# Altium project span-ion-cfd.PrjPcb
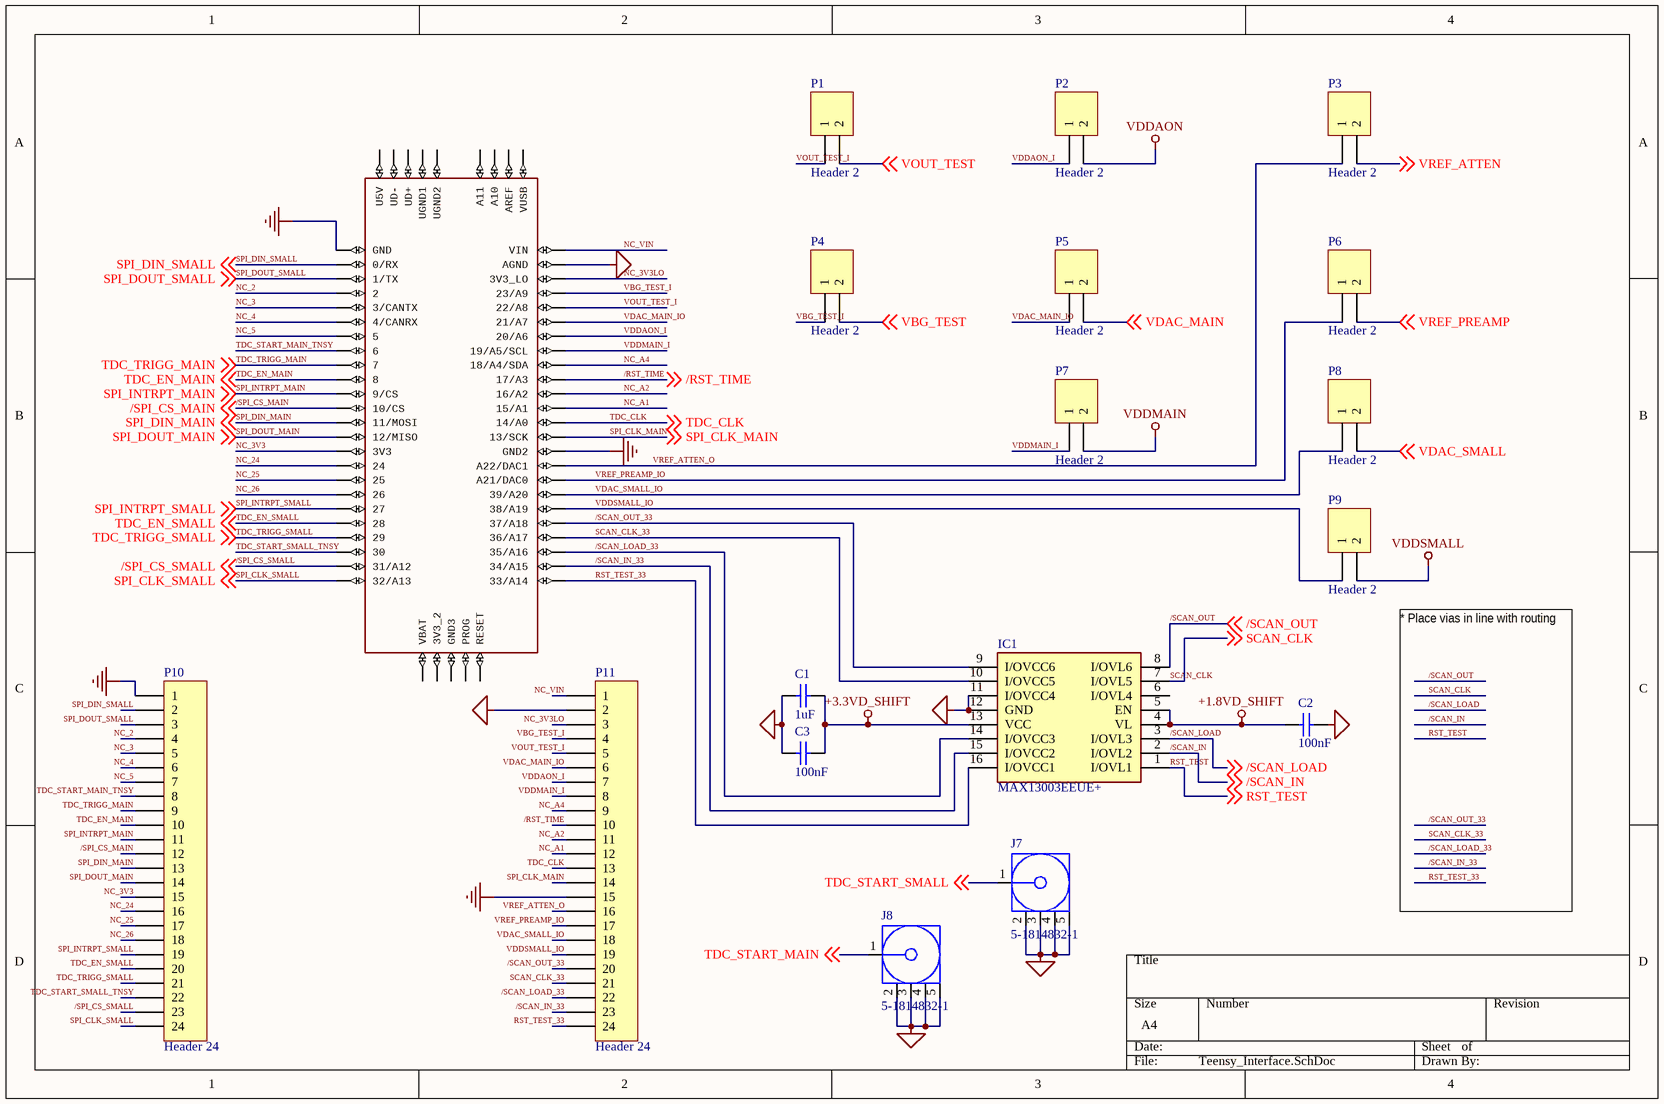
[diagram p0: Teensy_Interface.SchDoc]
4 sheets, 123 parts. Net scope: global (net labels, ports and power ports of the same name join across sheets).
Board file: CFD_Chip_Test.PcbDoc
Sheets:
  Teensy_Interface.SchDoc
  Chip.SchDoc
  Chip_Inputs.SchDoc
  Power.SchDoc

## Sheet Teensy_Interface.SchDoc
size A4; SheetNumber: 1; SheetTotal: 4

### Parts
C1  1uF  [CAPC1608X90X35ML10T15]
C2  100nF  [CAPC1608X90X35ML10T15]
C3  100nF  [CAPC1608X90X35ML10T15]
IC1  MAX13003EEUE+  [SOP65P640X110-16N]
J7  5-1814832-1  [TECO-5-1814832-1_V]
J8  5-1814832-1  [TECO-5-1814832-1_V]
P1  Header 2  [HDR1X2]
P2  Header 2  [HDR1X2]
P3  Header 2  [HDR1X2]
P4  Header 2  [HDR1X2]
P5  Header 2  [HDR1X2]
P6  Header 2  [HDR1X2]
P7  Header 2  [HDR1X2]
P8  Header 2  [HDR1X2]
P9  Header 2  [HDR1X2]
P10  Header 24  [HDR1X24]
P11  Header 24  [HDR1X24]
TEENSY1  TEENSY_3.5/3.6  [TEENSY_3.5/3.6]  (value not drawn)

### Nets
+1.8VD_SHIFT: C2.1 IC1.4(VL) IC1.5(EN)
+3.3VD_SHIFT: C1.2 C3.2 IC1.13(VCC)
GND: C1.1 C2.2 C3.1 IC1.11(I/OVCC4) IC1.12(GND) J7.2 J7.3 J7.4 J7.5 J8.2 J8.3 J8.4 J8.5 P10.1 P11.2 P11.15 TEENSY1.AGND TEENSY1.GND TEENSY1.GND2
VDDAON: P2.2
VDDMAIN: P7.2
VDDSMALL: P9.2
/RST_TIME: P11.10 TEENSY1.17/A3 ; off-sheet /RST_TIME
/SCAN_IN: IC1.2(I/OVL2) ; off-sheet /SCAN_IN
/SCAN_IN_33: IC1.15(I/OVCC2) P11.23 TEENSY1.34/A15
/SCAN_LOAD: IC1.3(I/OVL3) ; off-sheet /SCAN_LOAD
/SCAN_LOAD_33: IC1.14(I/OVCC3) P11.22 TEENSY1.35/A16
/SCAN_OUT: IC1.8(I/OVL6) ; off-sheet /SCAN_OUT
/SCAN_OUT_33: IC1.9(I/OVCC6) P11.20 TEENSY1.37/A18
/SPI_CS_MAIN: P10.12 TEENSY1.10/CS ; off-sheet /SPI_CS_MAIN
/SPI_CS_SMALL: P10.23 TEENSY1.31/A12 ; off-sheet /SPI_CS_SMALL
NC_2: P10.4 TEENSY1.2
NC_3: P10.5 TEENSY1.3/CANTX
NC_3V3: P10.15 TEENSY1.3V3
NC_3V3LO: P11.3 TEENSY1.3V3_LO
NC_4: P10.6 TEENSY1.4/CANRX
NC_5: P10.7 TEENSY1.5
NC_24: P10.16 TEENSY1.24
NC_25: P10.17 TEENSY1.25
NC_26: P10.18 TEENSY1.26
NC_A1: P11.12 TEENSY1.15/A1
NC_A2: P11.11 TEENSY1.16/A2
NC_A4: P11.9 TEENSY1.18/A4/SDA
NC_VIN: P11.1 TEENSY1.VIN
RST_TEST: IC1.1(I/OVL1) ; off-sheet RST_TEST
RST_TEST_33: IC1.16(I/OVCC1) P11.24 TEENSY1.33/A14
SCAN_CLK: IC1.7(I/OVL5) ; off-sheet SCAN_CLK
SCAN_CLK_33: IC1.10(I/OVCC5) P11.21 TEENSY1.36/A17
SPI_CLK_MAIN: P11.14 TEENSY1.13/SCK ; off-sheet SPI_CLK_MAIN
SPI_CLK_SMALL: P10.24 TEENSY1.32/A13 ; off-sheet SPI_CLK_SMALL
SPI_DIN_MAIN: P10.13 TEENSY1.11/MOSI ; off-sheet SPI_DIN_MAIN
SPI_DIN_SMALL: P10.2 TEENSY1.0/RX ; off-sheet SPI_DIN_SMALL
SPI_DOUT_MAIN: P10.14 TEENSY1.12/MISO ; off-sheet SPI_DOUT_MAIN
SPI_DOUT_SMALL: P10.3 TEENSY1.1/TX ; off-sheet SPI_DOUT_SMALL
SPI_INTRPT_MAIN: P10.11 TEENSY1.9/CS ; off-sheet SPI_INTRPT_MAIN
SPI_INTRPT_SMALL: P10.19 TEENSY1.27 ; off-sheet SPI_INTRPT_SMALL
TDC_CLK: P11.13 TEENSY1.14/A0 ; off-sheet TDC_CLK
TDC_EN_MAIN: P10.10 TEENSY1.8 ; off-sheet TDC_EN_MAIN
TDC_EN_SMALL: P10.20 TEENSY1.28 ; off-sheet TDC_EN_SMALL
TDC_START_MAIN: J8.1 ; off-sheet TDC_START_MAIN
TDC_START_MAIN_TNSY: P10.8 TEENSY1.6
TDC_START_SMALL: J7.1 ; off-sheet TDC_START_SMALL
TDC_START_SMALL_TNSY: P10.22 TEENSY1.30
TDC_TRIGG_MAIN: P10.9 TEENSY1.7 ; off-sheet TDC_TRIGG_MAIN
TDC_TRIGG_SMALL: P10.21 TEENSY1.29 ; off-sheet TDC_TRIGG_SMALL
VBG_TEST: P4.2 ; off-sheet VBG_TEST
VBG_TEST_I: P4.1 P11.4 TEENSY1.23/A9
VDAC_MAIN: P5.2 ; off-sheet VDAC_MAIN
VDAC_MAIN_IO: P5.1 P11.6 TEENSY1.21/A7
VDAC_SMALL: P8.2 ; off-sheet VDAC_SMALL
VDAC_SMALL_IO: P8.1 P11.18 TEENSY1.39/A20
VDDAON_I: P2.1 P11.7 TEENSY1.20/A6
VDDMAIN_I: P7.1 P11.8 TEENSY1.19/A5/SCL
VDDSMALL_IO: P9.1 P11.19 TEENSY1.38/A19
VOUT_TEST: P1.2 ; off-sheet VOUT_TEST
VOUT_TEST_I: P1.1 P11.5 TEENSY1.22/A8
VREF_ATTEN: P3.2 ; off-sheet VREF_ATTEN
VREF_ATTEN_O: P3.1 P11.16 TEENSY1.A22/DAC1
VREF_PREAMP: P6.2 ; off-sheet VREF_PREAMP
VREF_PREAMP_IO: P6.1 P11.17 TEENSY1.21/DAC0(A21/DAC0)

Not connected (* = marked no-connect by the designer): IC1 6(I/OVL4); TEENSY1 3V3_2 A10 A11 AREF GND3 PROG RESET U5V UD+ UD- UGND1 UGND2 VBAT VUSB

### Notes on the sheet
- * Place vias in line with routing

### Library data of the parts
C1-C3 = CMP-2000-04945-1: 0603; Manufacturer: Murata; Capacitance: 22pF; Tolerance (%): ±5%; Rated Voltage: 50V; Dielectric: C0G; Manufacturer URL: http://www.murata.com/; Datasheet Version: Jul-06; Package Reference: 603; Case Size/Dimension: 0603; Package Description: 2-Pin Surface Mount Device, Body 1.6 x 0.8 mm; Datasheet URL: https://datasheet.ciiva.com/11786/0900766b807a1cab-11786398.pdf
IC1 = MAX13003EEUE+: Integrated Circuit; Manufacturer_Name: Maxim Integrated; Datasheet Link: https://pdfserv.maximintegrated.com/en/ds/MAX13000E-MAX13005E.pdf; Height: 1.1mm; Manufacturer_Part_Number: MAX13003EEUE+
J7 J8 = CMP-2000-05415-1: SMA Connector, Pitch 5.08 mm, 1 Position, Height 9.5 mm, Tail Length 4 mm, -65 to 165 degC, RoHS, Bulk; Manufacturer: TE Connectivity; Connector Mounting: PCBMount; Connector Body Style: StraightJack; Impedance: 50ohm; Coaxial Termination: Solder; SVHC: NoSVHC(15-Jun-2015); Frequency Max: 3GHz; Product Range: ZDCSeries; Connector Type: SMACoaxial; Datasheet Version: Rev. B1, 03/2011; Package Reference: 5-1814832-1; Package Description: SMA Connector, Pitch 5.08 mm, 1 Position, Height 9.5 mm, Tail Length 4 mm; Contact Plating: GoldPlatedContacts; Coaxial Cable Types: -; Contact Material: BerylliumCopper; Manufacturer URL: http://www.te.com/; Datasheet URL: http://www.onlinecomponents.com/productFiles/mf-AMP/eng_cd_1814832_a.pdf
P1-P9 = Header 2: Header, 2-Pin; LatestRevisionDate: 17-Jul-2002; LatestRevisionNote: Re-released for DXP Platform.; Publisher: Altium Limited
P10 P11 = Header 24: Header, 24-Pin; LatestRevisionDate: 17-Jul-2002; LatestRevisionNote: Re-released for DXP Platform.; Publisher: Altium Limited
TEENSY1 = TEENSY_3.5/3.6: GateName_1: G$1; SymbolName_1: TEENSY_3.5/3.6; LibraryName: Teensy356; DeviceSetName: TEENSY_3.5/3.6; Package: TEENSY_3.5/3.6

## Sheet Chip.SchDoc
size A4; SheetNumber: 2; SheetTotal: 4
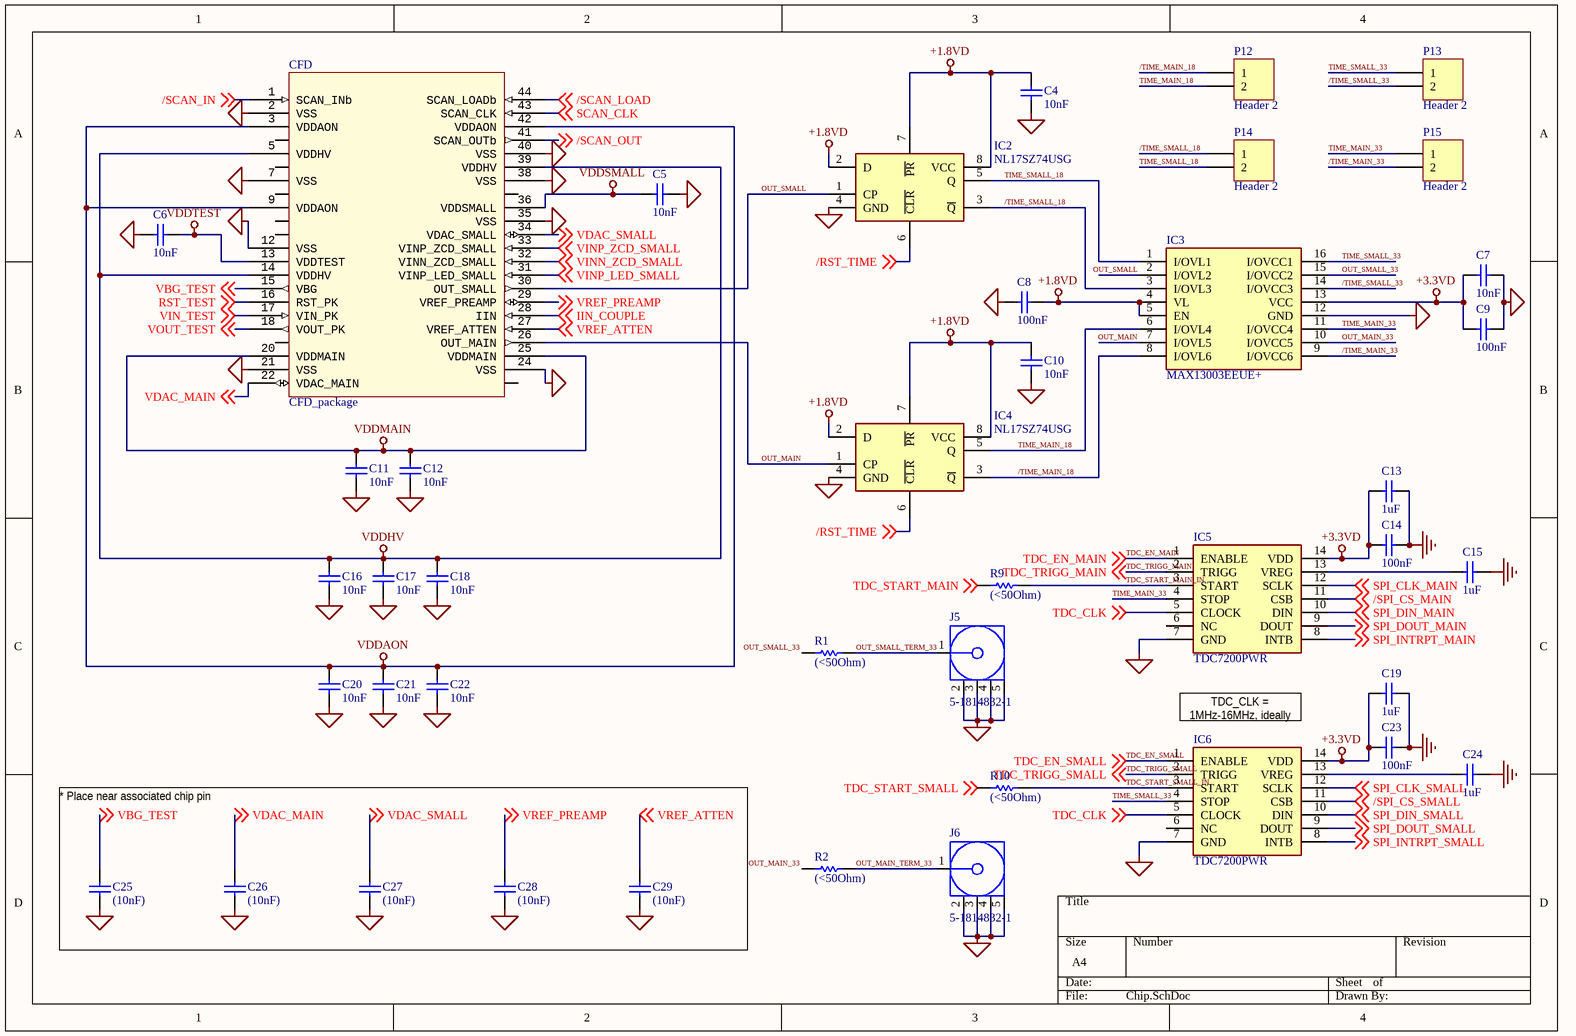
[diagram p1: Chip.SchDoc]

### Parts
C4  10nF  [CAPC1608X90X35ML10T15]
C5  10nF  [CAPC1608X90X35ML10T15]
C6  10nF  [CAPC1608X90X35ML10T15]
C7  10nF  [CAPC1608X90X35ML10T15]
C8  100nF  [CAPC1608X90X35ML10T15]
C9  100nF  [CAPC1608X90X35ML10T15]
C10  10nF  [CAPC1608X90X35ML10T15]
C11  10nF  [CAPC1608X90X35ML10T15]
C12  10nF  [CAPC1608X90X35ML10T15]
C13  1uF  [CAPC1608X90X35ML10T15]
C14  100nF  [CAPC1608X90X35ML10T15]
C15  1uF  [CAPC1608X90X35ML10T15]
C16  10nF  [CAPC1608X90X35ML10T15]
C17  10nF  [CAPC1608X90X35ML10T15]
C18  10nF  [CAPC1608X90X35ML10T15]
C19  1uF  [CAPC1608X90X35ML10T15]
C20  10nF  [CAPC1608X90X35ML10T15]
C21  10nF  [CAPC1608X90X35ML10T15]
C22  10nF  [CAPC1608X90X35ML10T15]
C23  100nF  [CAPC1608X90X35ML10T15]
C24  1uF  [CAPC1608X90X35ML10T15]
C25  (10nF)  [CAPC1608X90X35ML10T15]
C26  (10nF)  [CAPC1608X90X35ML10T15]
C27  (10nF)  [CAPC1608X90X35ML10T15]
C28  (10nF)  [CAPC1608X90X35ML10T15]
C29  (10nF)  [CAPC1608X90X35ML10T15]
CFD  CFD_package  [QFN50P700X700X80_HS-45N_WIDEVIAS]
IC2  NL17SZ74USG  [SOP50P310X90-8N]
IC3  MAX13003EEUE+  [SOP65P640X110-16N]
IC4  NL17SZ74USG  [SOP50P310X90-8N]
IC5  TDC7200PWR  [SOP65P640X120-14N]
IC6  TDC7200PWR  [SOP65P640X120-14N]
J5  5-1814832-1  [TECO-5-1814832-1_V]
J6  5-1814832-1  [TECO-5-1814832-1_V]
P12  Header 2  [HDR1X2]
P13  Header 2  [HDR1X2]
P14  Header 2  [HDR1X2]
P15  Header 2  [HDR1X2]
R1  (<50Ohm)  [RESC1609X50X30NL8T20]
R2  (<50Ohm)  [RESC1609X50X30NL8T20]
R9  (<50Ohm)  [RESC1609X50X30NL8T20]
R10  (<50Ohm)  [RESC1609X50X30NL8T20]

### Nets
+1.8VD: C4.2 C8.2 C10.2 IC2.2(D) IC2.7(~{PR}) IC2.8(VCC) IC3.4(VL) IC3.5(EN) IC4.2(D) IC4.7(~{PR}) IC4.8(VCC)
+3.3VD: C7.2 C9.2 C13.1 C14.1 C19.1 C23.1 IC3.13(VCC) IC5.14(VDD) IC6.14(VDD)
GND: C4.1 C5.1 C6.2 C7.1 C8.1 C9.1 C10.1 C11.1 C12.1 C13.2 C14.2 C15.2 C16.1 C17.1 C18.1 C19.2 C20.1 C21.1 C22.1 C23.2 C24.2 C25.1 C26.1 C27.1 C28.1 C29.1 CFD.2(VSS) CFD.7(VSS) CFD.12(VSS) CFD.21(VSS) CFD.24(VSS) CFD.35(VSS) CFD.38(VSS) CFD.40(VSS) IC2.4(GND) IC3.12(GND) IC4.4(GND) IC5.7(GND) IC6.7(GND) J5.2 J5.3 J5.4 J5.5 J6.2 J6.3 J6.4 J6.5
VDDAON: C20.2 C21.2 C22.2 CFD.3(VDDAON) CFD.9(VDDAON) CFD.42(VDDAON)
VDDHV: C16.2 C17.2 C18.2 CFD.5(VDDHV) CFD.14(VDDHV) CFD.39(VDDHV)
VDDMAIN: C11.2 C12.2 CFD.20(VDDMAIN) CFD.25(VDDMAIN)
VDDSMALL: C5.2 CFD.36(VDDSMALL)
VDDTEST: C6.1 CFD.13(VDDTEST)
/RST_TIME: IC2.6(~{CLR}) IC4.6(~{CLR}) ; off-sheet /RST_TIME
/SCAN_IN: CFD.1(SCAN_INb) ; off-sheet /SCAN_IN
/SCAN_LOAD: CFD.44(SCAN_LOADb) ; off-sheet /SCAN_LOAD
/SCAN_OUT: CFD.41(SCAN_OUTb) ; off-sheet /SCAN_OUT
/SPI_CS_MAIN: IC5.11(CSB) ; off-sheet /SPI_CS_MAIN
/SPI_CS_SMALL: IC6.11(CSB) ; off-sheet /SPI_CS_SMALL
/TIME_MAIN_18: IC3.8(I/OVL6) IC4.3(~{Q}) P12.1
/TIME_MAIN_33: IC3.9(I/OVCC6) P15.2
/TIME_SMALL_18: IC2.3(~{Q}) IC3.3(I/OVL3) P14.1
/TIME_SMALL_33: IC3.14(I/OVCC3) P13.2
IIN_COUPLE: CFD.28(IIN) ; off-sheet IIN_COUPLE
OUT_MAIN: CFD.26(OUT_MAIN) IC3.7(I/OVL5) IC4.1(CP)
OUT_MAIN_33: IC3.10(I/OVCC5) R2.2
OUT_MAIN_TERM_33: J6.1 R2.1
OUT_SMALL: CFD.30(OUT_SMALL) IC2.1(CP) IC3.2(I/OVL2)
OUT_SMALL_33: IC3.15(I/OVCC2) R1.2
OUT_SMALL_TERM_33: J5.1 R1.1
RST_TEST: CFD.16(RST_PK) ; off-sheet RST_TEST
SCAN_CLK: CFD.43(SCAN_CLK) ; off-sheet SCAN_CLK
SPI_CLK_MAIN: IC5.12(SCLK) ; off-sheet SPI_CLK_MAIN
SPI_CLK_SMALL: IC6.12(SCLK) ; off-sheet SPI_CLK_SMALL
SPI_DIN_MAIN: IC5.10(DIN) ; off-sheet SPI_DIN_MAIN
SPI_DIN_SMALL: IC6.10(DIN) ; off-sheet SPI_DIN_SMALL
SPI_DOUT_MAIN: IC5.9(DOUT) ; off-sheet SPI_DOUT_MAIN
SPI_DOUT_SMALL: IC6.9(DOUT) ; off-sheet SPI_DOUT_SMALL
SPI_INTRPT_MAIN: IC5.8(INTB) ; off-sheet SPI_INTRPT_MAIN
SPI_INTRPT_SMALL: IC6.8(INTB) ; off-sheet SPI_INTRPT_SMALL
TDC_CLK: IC5.5(CLOCK) IC6.5(CLOCK) ; off-sheet TDC_CLK
TDC_EN_MAIN: IC5.1(ENABLE) ; off-sheet TDC_EN_MAIN
TDC_EN_SMALL: IC6.1(ENABLE) ; off-sheet TDC_EN_SMALL
TDC_START_MAIN: R9.2 ; off-sheet TDC_START_MAIN
TDC_START_MAIN_IN: IC5.3(START) R9.1
TDC_START_SMALL: R10.2 ; off-sheet TDC_START_SMALL
TDC_START_SMALL_IN: IC6.3(START) R10.1
TDC_TRIGG_MAIN: IC5.2(TRIGG) ; off-sheet TDC_TRIGG_MAIN
TDC_TRIGG_SMALL: IC6.2(TRIGG) ; off-sheet TDC_TRIGG_SMALL
TIME_MAIN_18: IC3.6(I/OVL4) IC4.5(Q) P12.2
TIME_MAIN_33: IC3.11(I/OVCC4) IC5.4(STOP) P15.1
TIME_SMALL_18: IC2.5(Q) IC3.1(I/OVL1) P14.2
TIME_SMALL_33: IC3.16(I/OVCC1) IC6.4(STOP) P13.1
VBG_TEST: C25.2 CFD.15(VBG) ; off-sheet VBG_TEST
VDAC_MAIN: C26.2 CFD.22(VDAC_MAIN) ; off-sheet VDAC_MAIN
VDAC_SMALL: C27.2 CFD.34(VDAC_SMALL) ; off-sheet VDAC_SMALL
VIN_TEST: CFD.17(VIN_PK) ; off-sheet VIN_TEST
VINN_ZCD_SMALL: CFD.32(VINN_ZCD_SMALL) ; off-sheet VINN_ZCD_SMALL
VINP_LED_SMALL: CFD.31(VINP_LED_SMALL) ; off-sheet VINP_LED_SMALL
VINP_ZCD_SMALL: CFD.33(VINP_ZCD_SMALL) ; off-sheet VINP_ZCD_SMALL
VOUT_TEST: CFD.18(VOUT_PK) ; off-sheet VOUT_TEST
VREF_ATTEN: C29.2 CFD.27(VREF_ATTEN) ; off-sheet VREF_ATTEN
VREF_PREAMP: C28.2 CFD.29(VREF_PREAMP) ; off-sheet VREF_PREAMP
NetC15_1: C15.1 IC5.13(VREG)
NetC24_1: C24.1 IC6.13(VREG)

Not connected (* = marked no-connect by the designer): CFD 4 6 8 10 11 19 23 37; IC5 6(NC); IC6 6(NC)

### Notes on the sheet
- TDC_CLK = 1MHz-16MHz, ideally 16MHz
- * Place near associated chip pin

### Library data of the parts
C4-C29 = CMP-2000-04945-1: as C1 on sheet Teensy_Interface; Manufacturer URL: http://www.murata.com/; Datasheet Version: Jul-06; Package Reference: 603; Case Size/Dimension: 0603; Package Description: 2-Pin Surface Mount Device, Body 1.6 x 0.8 mm; Datasheet URL: https://datasheet.ciiva.com/11786/0900766b807a1cab-11786398.pdf
IC2 IC4 = NL17SZ74USG: Flip Flops 1.65-5.5V CMOS Single D-Type; Manufacturer_Name: ON Semiconductor; Datasheet Link: http://www.onsemi.com/pub/Collateral/NL17SZ74-D.PDF; Height: 0.9mm; Manufacturer_Part_Number: NL17SZ74USG
IC3 = MAX13003EEUE+: as IC1 on sheet Teensy_Interface; Datasheet Link: https://pdfserv.maximintegrated.com/en/ds/MAX13000E-MAX13005E.pdf; Height: 1.1mm; Manufacturer_Part_Number: MAX13003EEUE+
IC5 IC6 = TDC7200PWR: Integrated Circuit; Manufacturer_Name: Texas Instruments; Datasheet Link: http://www.ti.com/lit/gpn/tdc7200; Height: 1.2mm; Manufacturer_Part_Number: TDC7200PWR
J5 J6 = CMP-2000-05415-1: as J7 on sheet Teensy_Interface; Datasheet Version: Rev. B1, 03/2011; Package Reference: 5-1814832-1; Package Description: SMA Connector, Pitch 5.08 mm, 1 Position, Height 9.5 mm, Tail Length 4 mm; Contact Plating: GoldPlatedContacts; Coaxial Cable Types: -; Contact Material: BerylliumCopper; Manufacturer URL: http://www.te.com/; Datasheet URL: http://www.onlinecomponents.com/productFiles/mf-AMP/eng_cd_1814832_a.pdf
P12-P15 = Header 2: Header, 2-Pin; LatestRevisionDate: 17-Jul-2002; LatestRevisionNote: Re-released for DXP Platform.; Publisher: Altium Limited
R1 R2 R9 R10 = CMP-2000-03816-5: 0603; Manufacturer: Vishay Semiconductor; Voltage Rating: 75 V; Package Quantity: 5000; DatasheetVersion: 06/2012; Min Operating Temperature: -55 degC; ComponentLink1URL: http://www.vishay.com/; Mounting Technology: Surface Mount; Height: 0.45 mm; ComponentLink1Description: Manufacturer URL; REACH SVHC: Unknown; PackageReference: 0603; Packaging: Tape and Reel; Max Operating Temperature: 155 degC; Mount: Surface Mount; ComponentLink2Description: Datasheet; PackageDescription: 2-Pin Surface Mount Device, Body 1.575 x 0.85 mm; Length: 1.55 mm; ComponentLink2URL: http://www.vishay.com/docs/20035/dcrcwe3.pdf; Pins: 2; RoHSCompliant: true

## Sheet Chip_Inputs.SchDoc
size A4; SheetNumber: 3; SheetTotal: 4
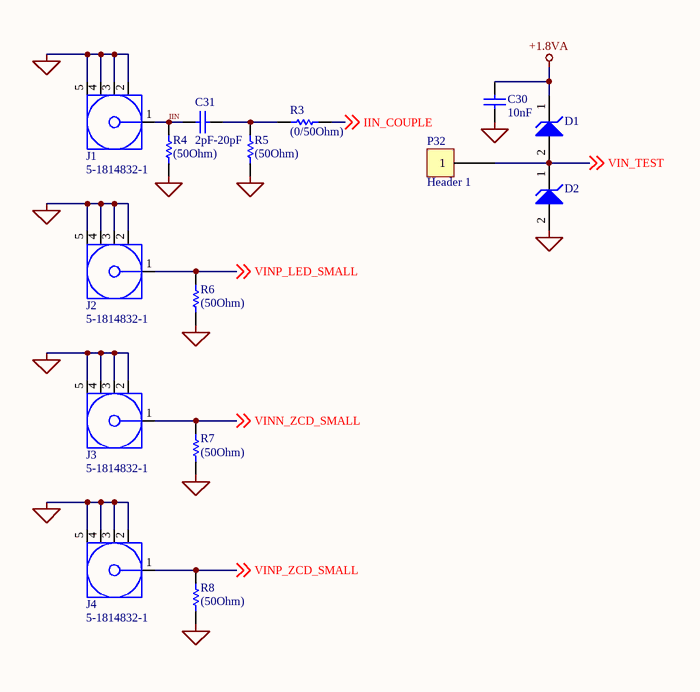
[diagram p2: Chip_Inputs.SchDoc]

### Parts
C30  10nF  [CAPC1608X90X35ML10T15]
C31  2pF-20pF  [CAPC1608X90X35ML10T15]
D1  (no value)  [ONSC-SOD-123-2-425-04_V]
D2  (no value)  [ONSC-SOD-123-2-425-04_V]
J1  5-1814832-1  [TECO-5-1814832-1_V]
J2  5-1814832-1  [TECO-5-1814832-1_V]
J3  5-1814832-1  [TECO-5-1814832-1_V]
J4  5-1814832-1  [TECO-5-1814832-1_V]
P32  Header 1  [Header1]
R3  (0/50Ohm)  [RESC1609X50X30NL8T20]
R4  (50Ohm)  [RESC1609X50X30NL8T20]
R5  (50Ohm)  [RESC1609X50X30NL8T20]
R6  (50Ohm)  [RESC1609X50X30NL8T20]
R7  (50Ohm)  [RESC1609X50X30NL8T20]
R8  (50Ohm)  [RESC1609X50X30NL8T20]

### Nets
+1.8VA: C30.2 D1.1(K)
GND: C30.1 D2.2(A) J1.2 J1.3 J1.4 J1.5 J2.2 J2.3 J2.4 J2.5 J3.2 J3.3 J3.4 J3.5 J4.2 J4.3 J4.4 J4.5 R4.1 R5.1 R6.1 R7.1 R8.1
IIN: C31.2 J1.1 R4.2
IIN_COUPLE: R3.1 ; off-sheet IIN_COUPLE
VIN_TEST: D1.2(A) D2.1(K) P32.1 ; off-sheet VIN_TEST
VINN_ZCD_SMALL: J3.1 R7.2 ; off-sheet VINN_ZCD_SMALL
VINP_LED_SMALL: J2.1 R6.2 ; off-sheet VINP_LED_SMALL
VINP_ZCD_SMALL: J4.1 R8.2 ; off-sheet VINP_ZCD_SMALL
NetC31_1: C31.1 R3.2 R5.2

### Library data of the parts
C30 C31 = CMP-2000-04945-1: as C1 on sheet Teensy_Interface; Manufacturer URL: http://www.murata.com/; Datasheet Version: Jul-06; Package Reference: 603; Case Size/Dimension: 0603; Package Description: 2-Pin Surface Mount Device, Body 1.6 x 0.8 mm; Datasheet URL: https://datasheet.ciiva.com/11786/0900766b807a1cab-11786398.pdf
D1 D2 = CMP-1060-00509-1: Zener Voltage Regulator, 2-Pin SOD-123, Pb-Free, Tape and Reel; Manufacturer: On Semiconductor; PartNumber: MMSZ4679T1G; P Max (W): 0.5; VZ Typ (V): 2; Packing: Tape and Reel; ComponentLink1Description: Manufacturer URL; DatasheetVersion: Rev. 9; PackageReference: SOD-123-2-425-04; ComponentLink3URL: http://www.onsemi.com/pub_link/Collateral/425-04.PDF; PackageDescription: 2-Pin SOD, Body 1.6 x 2.69 mm; ComponentLink3Description: Package Specification; ComponentLink2Description: Datasheet; ComponentLink1URL: http://www.onsemi.com/; RoHS: Pb-Free; PackageVersion: Rev. G, 10/2009; ComponentLink2URL: http://www.onsemi.com/pub_link/Collateral/MMSZ4678T1-D.PDF; Mounting Technology: Surface Mount
J1-J4 = CMP-2000-05415-1: as J7 on sheet Teensy_Interface; Datasheet Version: Rev. B1, 03/2011; Package Reference: 5-1814832-1; Package Description: SMA Connector, Pitch 5.08 mm, 1 Position, Height 9.5 mm, Tail Length 4 mm; Contact Plating: GoldPlatedContacts; Coaxial Cable Types: -; Contact Material: BerylliumCopper; Manufacturer URL: http://www.te.com/; Datasheet URL: http://www.onlinecomponents.com/productFiles/mf-AMP/eng_cd_1814832_a.pdf
R3-R8 = CMP-2000-03816-5: as R1 on sheet Chip; Package Quantity: 5000; DatasheetVersion: 06/2012; Min Operating Temperature: -55 degC; ComponentLink1URL: http://www.vishay.com/; Mounting Technology: Surface Mount; Height: 0.45 mm; ComponentLink1Description: Manufacturer URL; REACH SVHC: Unknown; PackageReference: 0603; Packaging: Tape and Reel; Max Operating Temperature: 155 degC; Mount: Surface Mount; ComponentLink2Description: Datasheet; PackageDescription: 2-Pin Surface Mount Device, Body 1.575 x 0.85 mm; Length: 1.55 mm; ComponentLink2URL: http://www.vishay.com/docs/20035/dcrcwe3.pdf; Pins: 2; RoHSCompliant: true

## Sheet Power.SchDoc
size A4; SheetNumber: 4; SheetTotal: 4
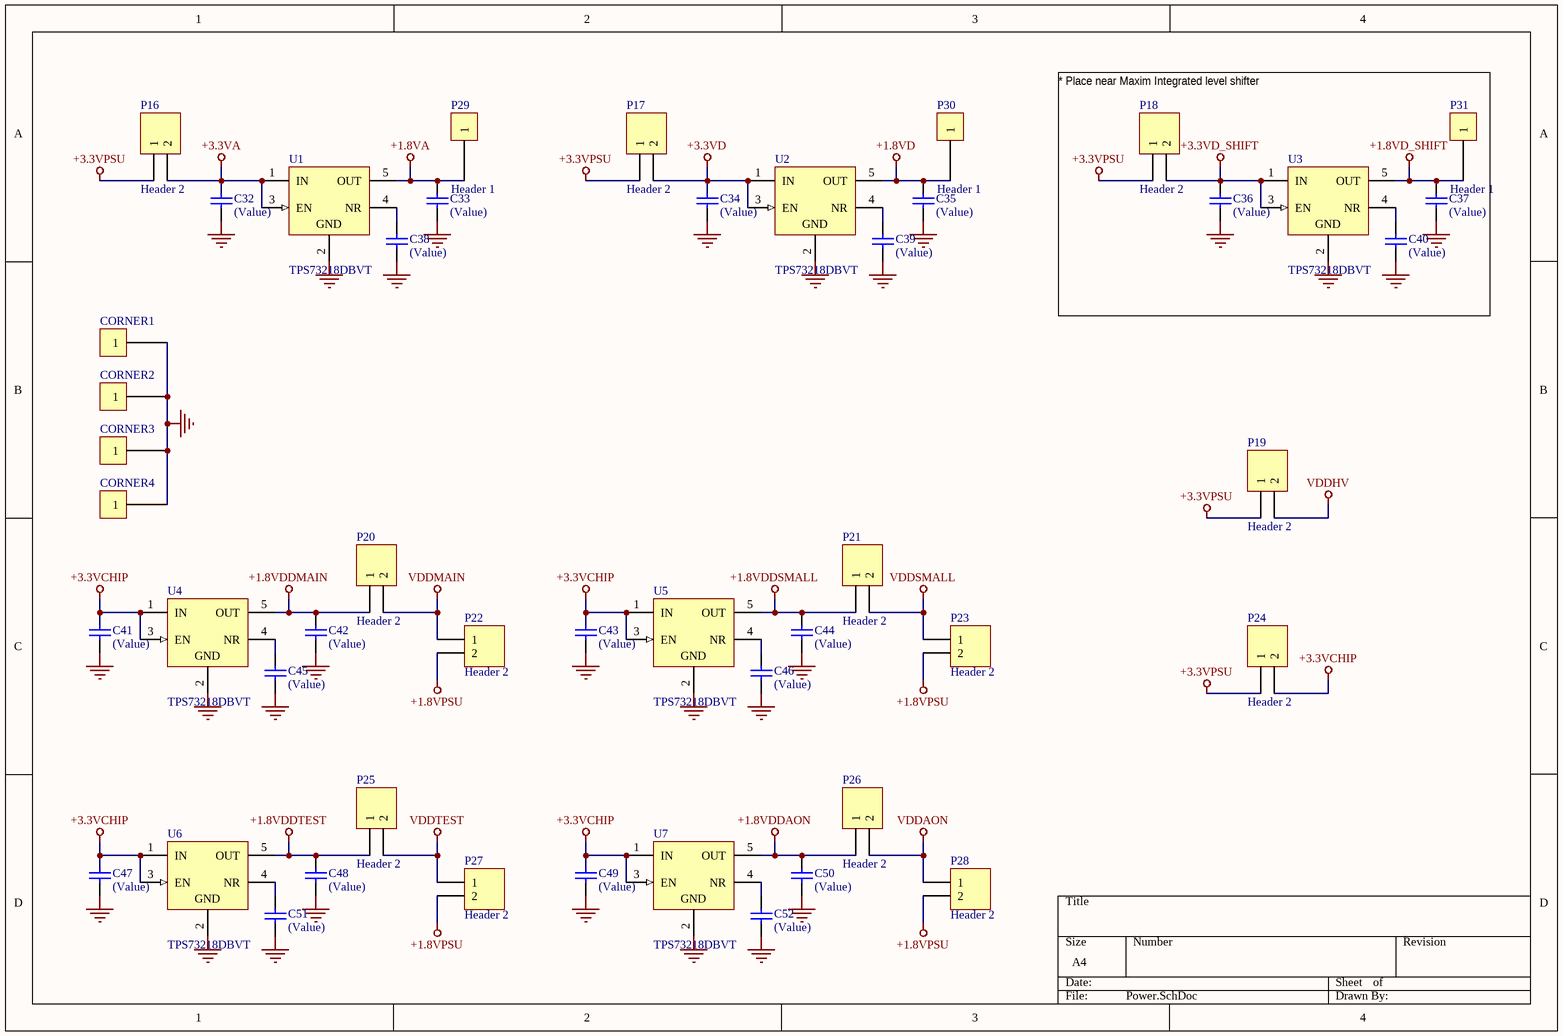
[diagram p3: Power.SchDoc]

### Parts
C32  (Value)  [CAPC1608X90X35ML10T15]
C33  (Value)  [CAPC1608X90X35ML10T15]
C34  (Value)  [CAPC1608X90X35ML10T15]
C35  (Value)  [CAPC1608X90X35ML10T15]
C36  (Value)  [CAPC1608X90X35ML10T15]
C37  (Value)  [CAPC1608X90X35ML10T15]
C38  (Value)  [CAPC1608X90X35ML10T15]
C39  (Value)  [CAPC1608X90X35ML10T15]
C40  (Value)  [CAPC1608X90X35ML10T15]
C41  (Value)  [CAPC1608X90X35ML10T15]
C42  (Value)  [CAPC1608X90X35ML10T15]
C43  (Value)  [CAPC1608X90X35ML10T15]
C44  (Value)  [CAPC1608X90X35ML10T15]
C45  (Value)  [CAPC1608X90X35ML10T15]
C46  (Value)  [CAPC1608X90X35ML10T15]
C47  (Value)  [CAPC1608X90X35ML10T15]
C48  (Value)  [CAPC1608X90X35ML10T15]
C49  (Value)  [CAPC1608X90X35ML10T15]
C50  (Value)  [CAPC1608X90X35ML10T15]
C51  (Value)  [CAPC1608X90X35ML10T15]
C52  (Value)  [CAPC1608X90X35ML10T15]
CORNER1  Corner Mount  [CornerMount]  (value not drawn)
CORNER2  Corner Mount  [CornerMount]  (value not drawn)
CORNER3  Corner Mount  [CornerMount]  (value not drawn)
CORNER4  Corner Mount  [CornerMount]  (value not drawn)
P16  Header 2  [HDR1X2]
P17  Header 2  [HDR1X2]
P18  Header 2  [HDR1X2]
P19  Header 2  [HDR1X2]
P20  Header 2  [HDR1X2]
P21  Header 2  [HDR1X2]
P22  Header 2  [HDR1X2]
P23  Header 2  [HDR1X2]
P24  Header 2  [HDR1X2]
P25  Header 2  [HDR1X2]
P26  Header 2  [HDR1X2]
P27  Header 2  [HDR1X2]
P28  Header 2  [HDR1X2]
P29  Header 1  [Header1]
P30  Header 1  [Header1]
P31  Header 1  [Header1]
U1  TPS73218DBVT  [DBV0005A_N]
U2  TPS73218DBVT  [DBV0005A_N]
U3  TPS73218DBVT  [DBV0005A_N]
U4  TPS73218DBVT  [DBV0005A_N]
U5  TPS73218DBVT  [DBV0005A_N]
U6  TPS73218DBVT  [DBV0005A_N]
U7  TPS73218DBVT  [DBV0005A_N]

### Nets
+1.8VA: C33.1 P29.1 U1.5(OUT)
+1.8VD: C35.1 P30.1 U2.5(OUT)
+1.8VD_SHIFT: C37.1 P31.1 U3.5(OUT)
+1.8VDDAON: C50.1 P26.1 U7.5(OUT)
+1.8VDDMAIN: C42.1 P20.1 U4.5(OUT)
+1.8VDDSMALL: C44.1 P21.1 U5.5(OUT)
+1.8VDDTEST: C48.1 P25.1 U6.5(OUT)
+1.8VPSU: P22.2 P23.2 P27.2 P28.2
+3.3VA: C32.1 P16.2 U1.1(IN) U1.3(EN)
+3.3VCHIP: C41.1 C43.1 C47.1 C49.1 P24.2 U4.1(IN) U4.3(EN) U5.1(IN) U5.3(EN) U6.1(IN) U6.3(EN) U7.1(IN) U7.3(EN)
+3.3VD: C34.1 P17.2 U2.1(IN) U2.3(EN)
+3.3VD_SHIFT: C36.1 P18.2 U3.1(IN) U3.3(EN)
+3.3VPSU: P16.1 P17.1 P18.1 P19.1 P24.1
GND: C32.2 C33.2 C34.2 C35.2 C36.2 C37.2 C38.2 C39.2 C40.2 C41.2 C42.2 C43.2 C44.2 C45.2 C46.2 C47.2 C48.2 C49.2 C50.2 C51.2 C52.2 CORNER1.1 CORNER2.1 CORNER3.1 CORNER4.1 U1.2(GND) U2.2(GND) U3.2(GND) U4.2(GND) U5.2(GND) U6.2(GND) U7.2(GND)
VDDAON: P26.2 P28.1
VDDHV: P19.2
VDDMAIN: P20.2 P22.1
VDDSMALL: P21.2 P23.1
VDDTEST: P25.2 P27.1
NetC38_1: C38.1 U1.4(NR)
NetC39_1: C39.1 U2.4(NR)
NetC40_1: C40.1 U3.4(NR)
NetC45_1: C45.1 U4.4(NR)
NetC46_1: C46.1 U5.4(NR)
NetC51_1: C51.1 U6.4(NR)
NetC52_1: C52.1 U7.4(NR)

### Notes on the sheet
- * Place near Maxim Integrated level shifter

### Library data of the parts
C32-C52 = CMP-2000-04945-1: as C1 on sheet Teensy_Interface; Manufacturer URL: http://www.murata.com/; Datasheet Version: Jul-06; Package Reference: 603; Case Size/Dimension: 0603; Package Description: 2-Pin Surface Mount Device, Body 1.6 x 0.8 mm; Datasheet URL: https://datasheet.ciiva.com/11786/0900766b807a1cab-11786398.pdf
P16-P28 = Header 2: Header, 2-Pin; LatestRevisionDate: 17-Jul-2002; LatestRevisionNote: Re-released for DXP Platform.; Publisher: Altium Limited
U1-U7 = CMP-0394-00378-2: Single Output Fast Transient Response LDO, 200 mA, Fixed 1.8 V Output, 1.7 to 5.5 V Input, with Reverse Current Protection, 5-pin SOT-23 (DBV), -40 to 85 degC, Green (RoHS & no Sb/Br); Manufacturer: Texas Instruments; Iout(Max)(A): 0.25; Iq(Typ)(mA): 0.4; Accuracy(%): 1; Vout Adj(Min)(V): 1.8; Vdo(Typ)(mV): 40; SubFamily: Single Channel LDO; Vin(Min)(V): 1.7; Vin(Max)(V): 5.5; ComponentLink1URL: http://www.ti.com/; PartNumber: TPS73218DBVT; Eco-Plan: Green (RoHS & no Sb/Br); ComponentLink2Description: Datasheet; PackageVersion: 4073253-4/K; ComponentLink3URL: http://www.ti.com/litv/pdf/mpds018i; ComponentLink3Description: Package Specification; ComponentLink1Description: Manufacturer URL; Vout Adj(Max)(V): 1.8; Code_JEDEC: MO-178; ComponentLink2URL: http://www.ti.com/general/docs/lit/getliterature.tsp?genericPartNumber=TPS73218&fileType=pdf; DatasheetVersion: SBVS037O; Mounting Technology: Surface Mount; PackageReference: DBV0005A; PackageDescription: 5-Pin Plastic Small Outline, Body 1.60 Ãƒâ€” 2.90 mm, Pitch 0.95 mm; Fixed Output Options(V): 1.8

## Nets that join several sheets
+1.8VA: Chip_Inputs (C30.2 D1.1), Power (C33.1 P29.1 U1.5)
+1.8VD: Chip (11 pins), Power (C35.1 P30.1 U2.5)
+1.8VD_SHIFT: Teensy_Interface (C2.1 IC1.4 IC1.5), Power (C37.1 P31.1 U3.5)
+3.3VD: Chip (9 pins), Power (C34.1 P17.2 U2.1 U2.3)
+3.3VD_SHIFT: Teensy_Interface (C1.2 C3.2 IC1.13), Power (C36.1 P18.2 U3.1 U3.3)
GND: Teensy_Interface (19 pins), Chip (47 pins), Chip_Inputs (23 pins), Power (32 pins)
VDDAON: Teensy_Interface (P2.2), Chip (6 pins), Power (P26.2 P28.1)
VDDHV: Chip (6 pins), Power (P19.2)
VDDMAIN: Teensy_Interface (P7.2), Chip (C11.2 C12.2 CFD.20 CFD.25), Power (P20.2 P22.1)
VDDSMALL: Teensy_Interface (P9.2), Chip (C5.2 CFD.36), Power (P21.2 P23.1)
VDDTEST: Chip (C6.1 CFD.13), Power (P25.2 P27.1)
/RST_TIME: Teensy_Interface (P11.10 TEENSY1.17/A3), Chip (IC2.6 IC4.6)
/SCAN_IN: Teensy_Interface (IC1.2), Chip (CFD.1)
/SCAN_LOAD: Teensy_Interface (IC1.3), Chip (CFD.44)
/SCAN_OUT: Teensy_Interface (IC1.8), Chip (CFD.41)
/SPI_CS_MAIN: Teensy_Interface (P10.12 TEENSY1.10/CS), Chip (IC5.11)
/SPI_CS_SMALL: Teensy_Interface (P10.23 TEENSY1.31/A12), Chip (IC6.11)
IIN_COUPLE: Chip (CFD.28), Chip_Inputs (R3.1)
RST_TEST: Teensy_Interface (IC1.1), Chip (CFD.16)
SCAN_CLK: Teensy_Interface (IC1.7), Chip (CFD.43)
SPI_CLK_MAIN: Teensy_Interface (P11.14 TEENSY1.13/SCK), Chip (IC5.12)
SPI_CLK_SMALL: Teensy_Interface (P10.24 TEENSY1.32/A13), Chip (IC6.12)
SPI_DIN_MAIN: Teensy_Interface (P10.13 TEENSY1.11/MOSI), Chip (IC5.10)
SPI_DIN_SMALL: Teensy_Interface (P10.2 TEENSY1.0/RX), Chip (IC6.10)
SPI_DOUT_MAIN: Teensy_Interface (P10.14 TEENSY1.12/MISO), Chip (IC5.9)
SPI_DOUT_SMALL: Teensy_Interface (P10.3 TEENSY1.1/TX), Chip (IC6.9)
SPI_INTRPT_MAIN: Teensy_Interface (P10.11 TEENSY1.9/CS), Chip (IC5.8)
SPI_INTRPT_SMALL: Teensy_Interface (P10.19 TEENSY1.27), Chip (IC6.8)
TDC_CLK: Teensy_Interface (P11.13 TEENSY1.14/A0), Chip (IC5.5 IC6.5)
TDC_EN_MAIN: Teensy_Interface (P10.10 TEENSY1.8), Chip (IC5.1)
TDC_EN_SMALL: Teensy_Interface (P10.20 TEENSY1.28), Chip (IC6.1)
TDC_START_MAIN: Teensy_Interface (J8.1), Chip (R9.2)
TDC_START_SMALL: Teensy_Interface (J7.1), Chip (R10.2)
TDC_TRIGG_MAIN: Teensy_Interface (P10.9 TEENSY1.7), Chip (IC5.2)
TDC_TRIGG_SMALL: Teensy_Interface (P10.21 TEENSY1.29), Chip (IC6.2)
VBG_TEST: Teensy_Interface (P4.2), Chip (C25.2 CFD.15)
VDAC_MAIN: Teensy_Interface (P5.2), Chip (C26.2 CFD.22)
VDAC_SMALL: Teensy_Interface (P8.2), Chip (C27.2 CFD.34)
VIN_TEST: Chip (CFD.17), Chip_Inputs (D1.2 D2.1 P32.1)
VINN_ZCD_SMALL: Chip (CFD.32), Chip_Inputs (J3.1 R7.2)
VINP_LED_SMALL: Chip (CFD.31), Chip_Inputs (J2.1 R6.2)
VINP_ZCD_SMALL: Chip (CFD.33), Chip_Inputs (J4.1 R8.2)
VOUT_TEST: Teensy_Interface (P1.2), Chip (CFD.18)
VREF_ATTEN: Teensy_Interface (P3.2), Chip (C29.2 CFD.27)
VREF_PREAMP: Teensy_Interface (P6.2), Chip (C28.2 CFD.29)